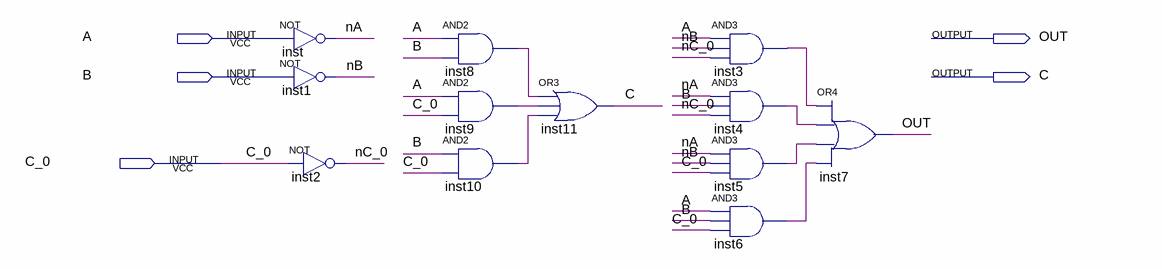
[diagram p0: schematic sheet]
// Quartus schematic ADD1.bdf as structural Verilog: 12 symbols, 5 pins
module ADD1 (
  input  A,
  input  B,
  input  C_0,
  output OUT,
  output C
);

  wire inst3_out, inst4_out, inst5_out, inst6_out, inst8_out, inst9_out, inst10_out, nA, nB, nC_0;

  not inst (nA, A);
  not inst1 (nB, B);
  not inst2 (nC_0, C_0);
  and inst8 (inst8_out, A, B);
  and inst9 (inst9_out, A, C_0);
  and inst10 (inst10_out, B, C_0);
  or inst11 (C, inst8_out, inst9_out, inst10_out);
  and inst3 (inst3_out, A, nB, nC_0);
  and inst4 (inst4_out, nA, B, nC_0);
  and inst5 (inst5_out, nA, nB, C_0);
  and inst6 (inst6_out, A, B, C_0);
  or inst7 (OUT, inst3_out, inst4_out, inst5_out, inst6_out);
endmodule
